# Altium schematic sheet Regulator_cct.SchDoc
size A4
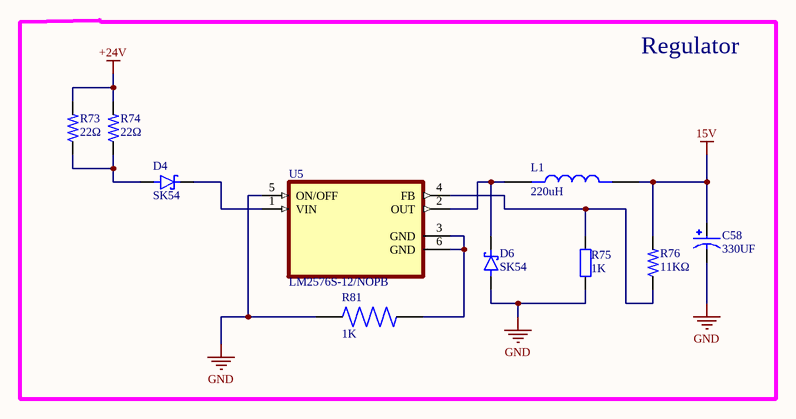
[diagram p0: Regulator_cct.SchDoc]

## Parts
C58  330UF  [CAP_EEETC1C331V]
D4  SK54  [DIOM7959X265N]
D6  SK54  [DIOM7959X265N]
L1  220uH  [IND_MDH12577C-101MA=P3]
R73  22Ω  [R-2512R]
R74  22Ω  [R-2512R]
R75  Deger: 1K  [R-0805W]  (hidden comment: RES SMD 1K OHM 1% 1/8W 0805)
R76  11KΩ  [R-0805R]
R81  1K  [RESC6332X65N]
U5  LM2576S-12/NOPB  [VREG_TPS79625KTTR]

## Blocks framed on the sheet
Regulator: C58 D4 D6 L1 R73-R76 R81 U5

## Nets
15V: C58.1 L1.2 R76.2
+24V: R73.2 R74.2
GND: C58.2 D6.A R75.1 R81.1 U5.5(ON/OFF)
NetD4_A: D4.A R73.1 R74.1
NetD4_C: D4.C(K) U5.1(VIN)
NetD6_C: D6.C(K) L1.1 U5.2(OUT)
NetR75_2: R75.2 R76.1 U5.4(FB)
NetR81_2: R81.2 U5.3(GND) U5.6(GND)

## Library data of the parts
C58 = CAP 330UF SMD: CAP ALUM 330UF 20% 16V SMD; MP: EEE-TC1C331V; MF: Panasonic Electronic Components; Value: *; Package: RADIAL-2 Panasonic; Availability: In Stock; SnapEDA_Link: https://www.snapeda.com/parts/EEE-TC1C331V/Panasonic/view-part/6178283/?ref=snap; Price: None; Purchase-URL: https://pricing.snapeda.com/search/part/EEE-TC1C331V/?ref=eda; Check_prices: https://www.snapeda.com/parts/EEE-TC1C331V/Panasonic/view-part/6178283/?ref=eda
D4 D6 = SK54: Diode Schottky 40V 5A Surface Mount DO-214AA (SMB); MP: MBRS320T3G; MF: ON Semiconductor; Package: DO-214 ON Semiconductor; Availability: Good; Arrow_Electronics-Purchase-URL: https://snapeda.com/shop?store=Arrow+Electronics&id=432205; SnapEDA_Link: https://www.snapeda.com/parts/MBRS320T3G/ON%20Semiconductor/view-part/432205/?ref=snap; DigiKey-Purchase-URL: https://snapeda.com/shop?store=DigiKey&id=432205; Mouser-Purchase-URL: https://snapeda.com/shop?store=Mouser&id=432205; Value: *; Price: None
L1 = 220uH Inductor SMD: Inductor Power Shielded Wirewound 220uH 20% 100KHz Ferrite 1.1A 0.325Ohm DCR 5049 Automotive T/R; MP: MDH12577C-101MA=P3; Package: None; Price: None; Value: *; Availability: Unavailable
R73 R74 = RES 22Ω 2512
R75 = 1K 0805: 1 kOhms ±1% 0.125W, 1/8W Chip Resistor 0805 (2012 Metric) Moisture Resistant Thick Film; Cins: Direnc; Uretici Kodu: RC0805FR-071KL; Kılıf: 0805; -Sicaklik: -55; +Sicaklik: +155; Lehim Yöntemi: SMD; MSL: 1 (Unlimited)
R76 = RES 11KΩ SMD: THICK FILM RESISTOR, 11KOHM, 125mW, 5%; MP: CRCW080511K0JNEA; Package: None; Price: None; Value: *; Availability: Unavailable
R81 = RES 1K 2512: Fixed Resistor CRGP 2512 1K0 1%; MF: TE Connectivity; MP: CRGP2512F1K0; Mouser-Purchase-URL: https://snapeda.com/shop?store=Mouser&id=3188667; Package: 6332 TE Connectivity; Price: None; Value: *; SnapEDA_Link: https://www.snapeda.com/parts/CRGP2512F1K0/TE%20Connectivity/view-part/3188667/?ref=snap; DigiKey-Purchase-URL: https://snapeda.com/shop?store=DigiKey&id=3188667; Availability: Unavailable
U5 = LM2576S-12/NOPB: SIMPLE SWITCHER&reg; 40V, 3A Low Component Count Step-Down Regulator 5-DDPAK/TO-263 -40 to 125; MF: Texas Instruments; Availability: Warning; SnapEDA_Link: https://www.snapeda.com/parts/LM2576S-12/NOPB/Texas%20Instruments/view-part/470772/?ref=snap; Mouser-Purchase-URL: https://snapeda.com/shop?store=Mouser&id=470772; Texas_Instruments-Purchase-URL: https://snapeda.com/shop?store=Texas+Instruments&id=470772; Value: *; Price: None; Package: TO-263-5 Texas Instruments; DigiKey-Purchase-URL: https://snapeda.com/shop?store=DigiKey&id=470772; MP: LM2576S-12/NOPB; BuyPart: https://www.snapeda.com/parts/LM2576S-12/NOPB/Texas%20Instruments/view-part/470772/?ref=eda